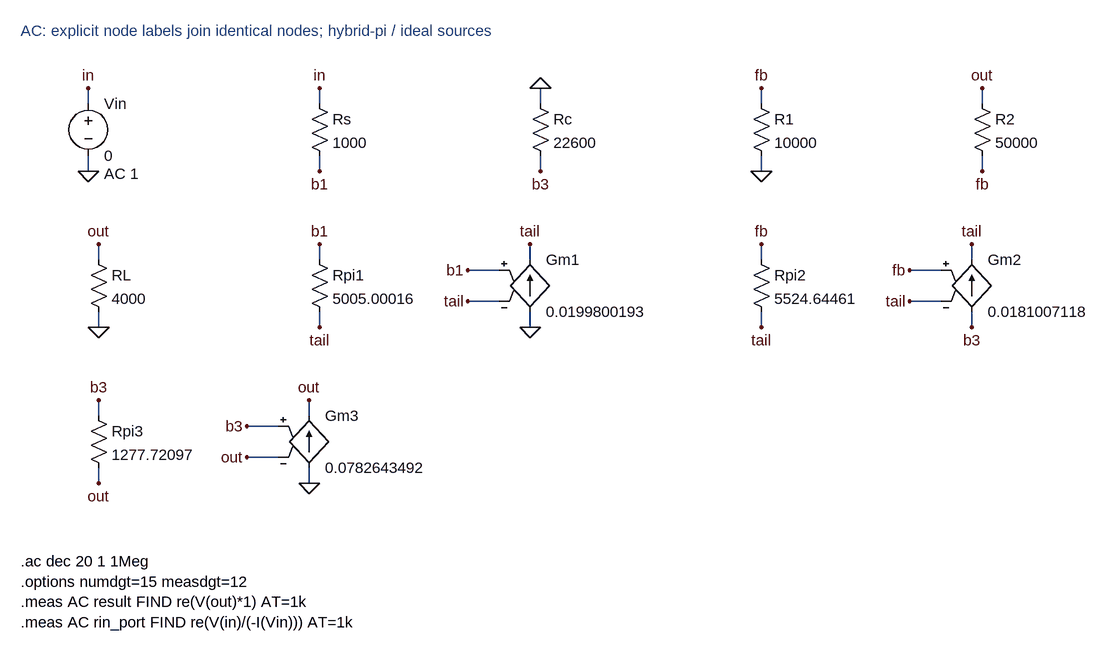
[diagram p0: schematic AC.asc]
AC.asc, the LTspice schematic file:
Version 4
SHEET 1 1800 1500
TEXT 16 -48 Left 2 ;AC: explicit node labels join identical nodes; hybrid-pi / ideal sources
WIRE 120 64 120 40
FLAG 120 40 in
WIRE 120 144 120 168
FLAG 120 168 0
SYMBOL voltage 120 48 R0
SYMATTR InstName Vin
WINDOW 123 24 124 Left 2
SYMATTR Value 0
SYMATTR Value2 AC 1
WIRE 476 64 476 40
FLAG 476 40 in
WIRE 476 144 476 168
FLAG 476 168 b1
SYMBOL res 460 48 R0
SYMATTR InstName Rs
SYMATTR Value 1000
WIRE 816 64 816 40
FLAG 816 40 0
WIRE 816 144 816 168
FLAG 816 168 b3
SYMBOL res 800 48 R0
SYMATTR InstName Rc
SYMATTR Value 22600
WIRE 1156 64 1156 40
FLAG 1156 40 fb
WIRE 1156 144 1156 168
FLAG 1156 168 0
SYMBOL res 1140 48 R0
SYMATTR InstName R1
SYMATTR Value 10000
WIRE 1496 64 1496 40
FLAG 1496 40 out
WIRE 1496 144 1496 168
FLAG 1496 168 fb
SYMBOL res 1480 48 R0
SYMATTR InstName R2
SYMATTR Value 50000
WIRE 136 304 136 280
FLAG 136 280 out
WIRE 136 384 136 408
FLAG 136 408 0
SYMBOL res 120 288 R0
SYMATTR InstName RL
SYMATTR Value 4000
WIRE 476 304 476 280
FLAG 476 280 b1
WIRE 476 384 476 408
FLAG 476 408 tail
SYMBOL res 460 288 R0
SYMATTR InstName Rpi1
SYMATTR Value 5005.00016
WIRE 800 384 800 408
FLAG 800 408 0
WIRE 800 304 800 280
FLAG 800 280 tail
WIRE 752 320 704 320
FLAG 704 320 b1
WIRE 752 368 704 368
FLAG 704 368 tail
SYMBOL g 800 288 R0
SYMATTR InstName Gm1
SYMATTR Value 0.0199800193
WIRE 1156 304 1156 280
FLAG 1156 280 fb
WIRE 1156 384 1156 408
FLAG 1156 408 tail
SYMBOL res 1140 288 R0
SYMATTR InstName Rpi2
SYMATTR Value 5524.64461
WIRE 1480 384 1480 408
FLAG 1480 408 b3
WIRE 1480 304 1480 280
FLAG 1480 280 tail
WIRE 1432 320 1384 320
FLAG 1384 320 fb
WIRE 1432 368 1384 368
FLAG 1384 368 tail
SYMBOL g 1480 288 R0
SYMATTR InstName Gm2
SYMATTR Value 0.0181007118
WIRE 136 544 136 520
FLAG 136 520 b3
WIRE 136 624 136 648
FLAG 136 648 out
SYMBOL res 120 528 R0
SYMATTR InstName Rpi3
SYMATTR Value 1277.72097
WIRE 460 624 460 648
FLAG 460 648 0
WIRE 460 544 460 520
FLAG 460 520 out
WIRE 412 560 364 560
FLAG 364 560 b3
WIRE 412 608 364 608
FLAG 364 608 out
SYMBOL g 460 528 R0
SYMATTR InstName Gm3
SYMATTR Value 0.0782643492
TEXT 16 768 Left 2 !.ac dec 20 1 1Meg\n.options numdgt=15 measdgt=12\n.meas AC result FIND re(V(out)*1) AT=1k\n.meas AC rin_port FIND re(V(in)/(-I(Vin))) AT=1k

The netlist it stands for:
* AC.asc
Vin in 0 0 AC 1
Rs in b1 1000
Rc 0 b3 22600
R1 fb 0 10000
R2 out fb 50000
RL out 0 4000
Rpi1 b1 tail 5005.00016
Gm1 0 tail b1 tail 0.0199800193
Rpi2 fb tail 5524.64461
Gm2 b3 tail fb tail 0.0181007118
Rpi3 b3 out 1277.72097
Gm3 0 out b3 out 0.0782643492
* AC: explicit node labels join identical nodes; hybrid-pi / ideal sources
.ac dec 20 1 1Meg
.options numdgt=15 measdgt=12
.meas AC result FIND re(V(out)*1) AT=1k
.meas AC rin_port FIND re(V(in)/(-I(Vin))) AT=1k
.backanno
.end

* Results of the author's LTspice run, read from the files saved beside the schematic
* From the log:
*   result: re(V(out)*1)=(15.0892769841dB,0°) at 1000
*   rin_port: re(V(in)/(-I(Vin)))=(111.462022589dB,0°) at 1000